# Altium schematic sheet Miscellaneous.SchDoc
size A3; PageSetup: Record=PageOptions|CenterHorizontal=True|CenterVertical=True|PrintScale=0.71|XCorrection=1.00|YCorrection=1.00|PrintKind=0|BorderSize=5000000|LeftOffset=0|BottomOffset=0|Orientation=2|PaperLength=1000|PaperWidth=1000|Scale=100|PaperSource=7|PrintQuality=-4|MediaType=1|DitherType=10|PaperKind=A4|PrintScaleMode=1; Date: 27.05.2014; DrawnBy: luths8; Organization: BFH; Address1: Bern University of Applied Sciences; Address2: Engineering and Information Technology; Address3: Jlcoweg 1; Address4: CH-3400 Burgdorf; DocumentNumber: 1; Revision: 1.0; CurrentDate: 27.05.2014
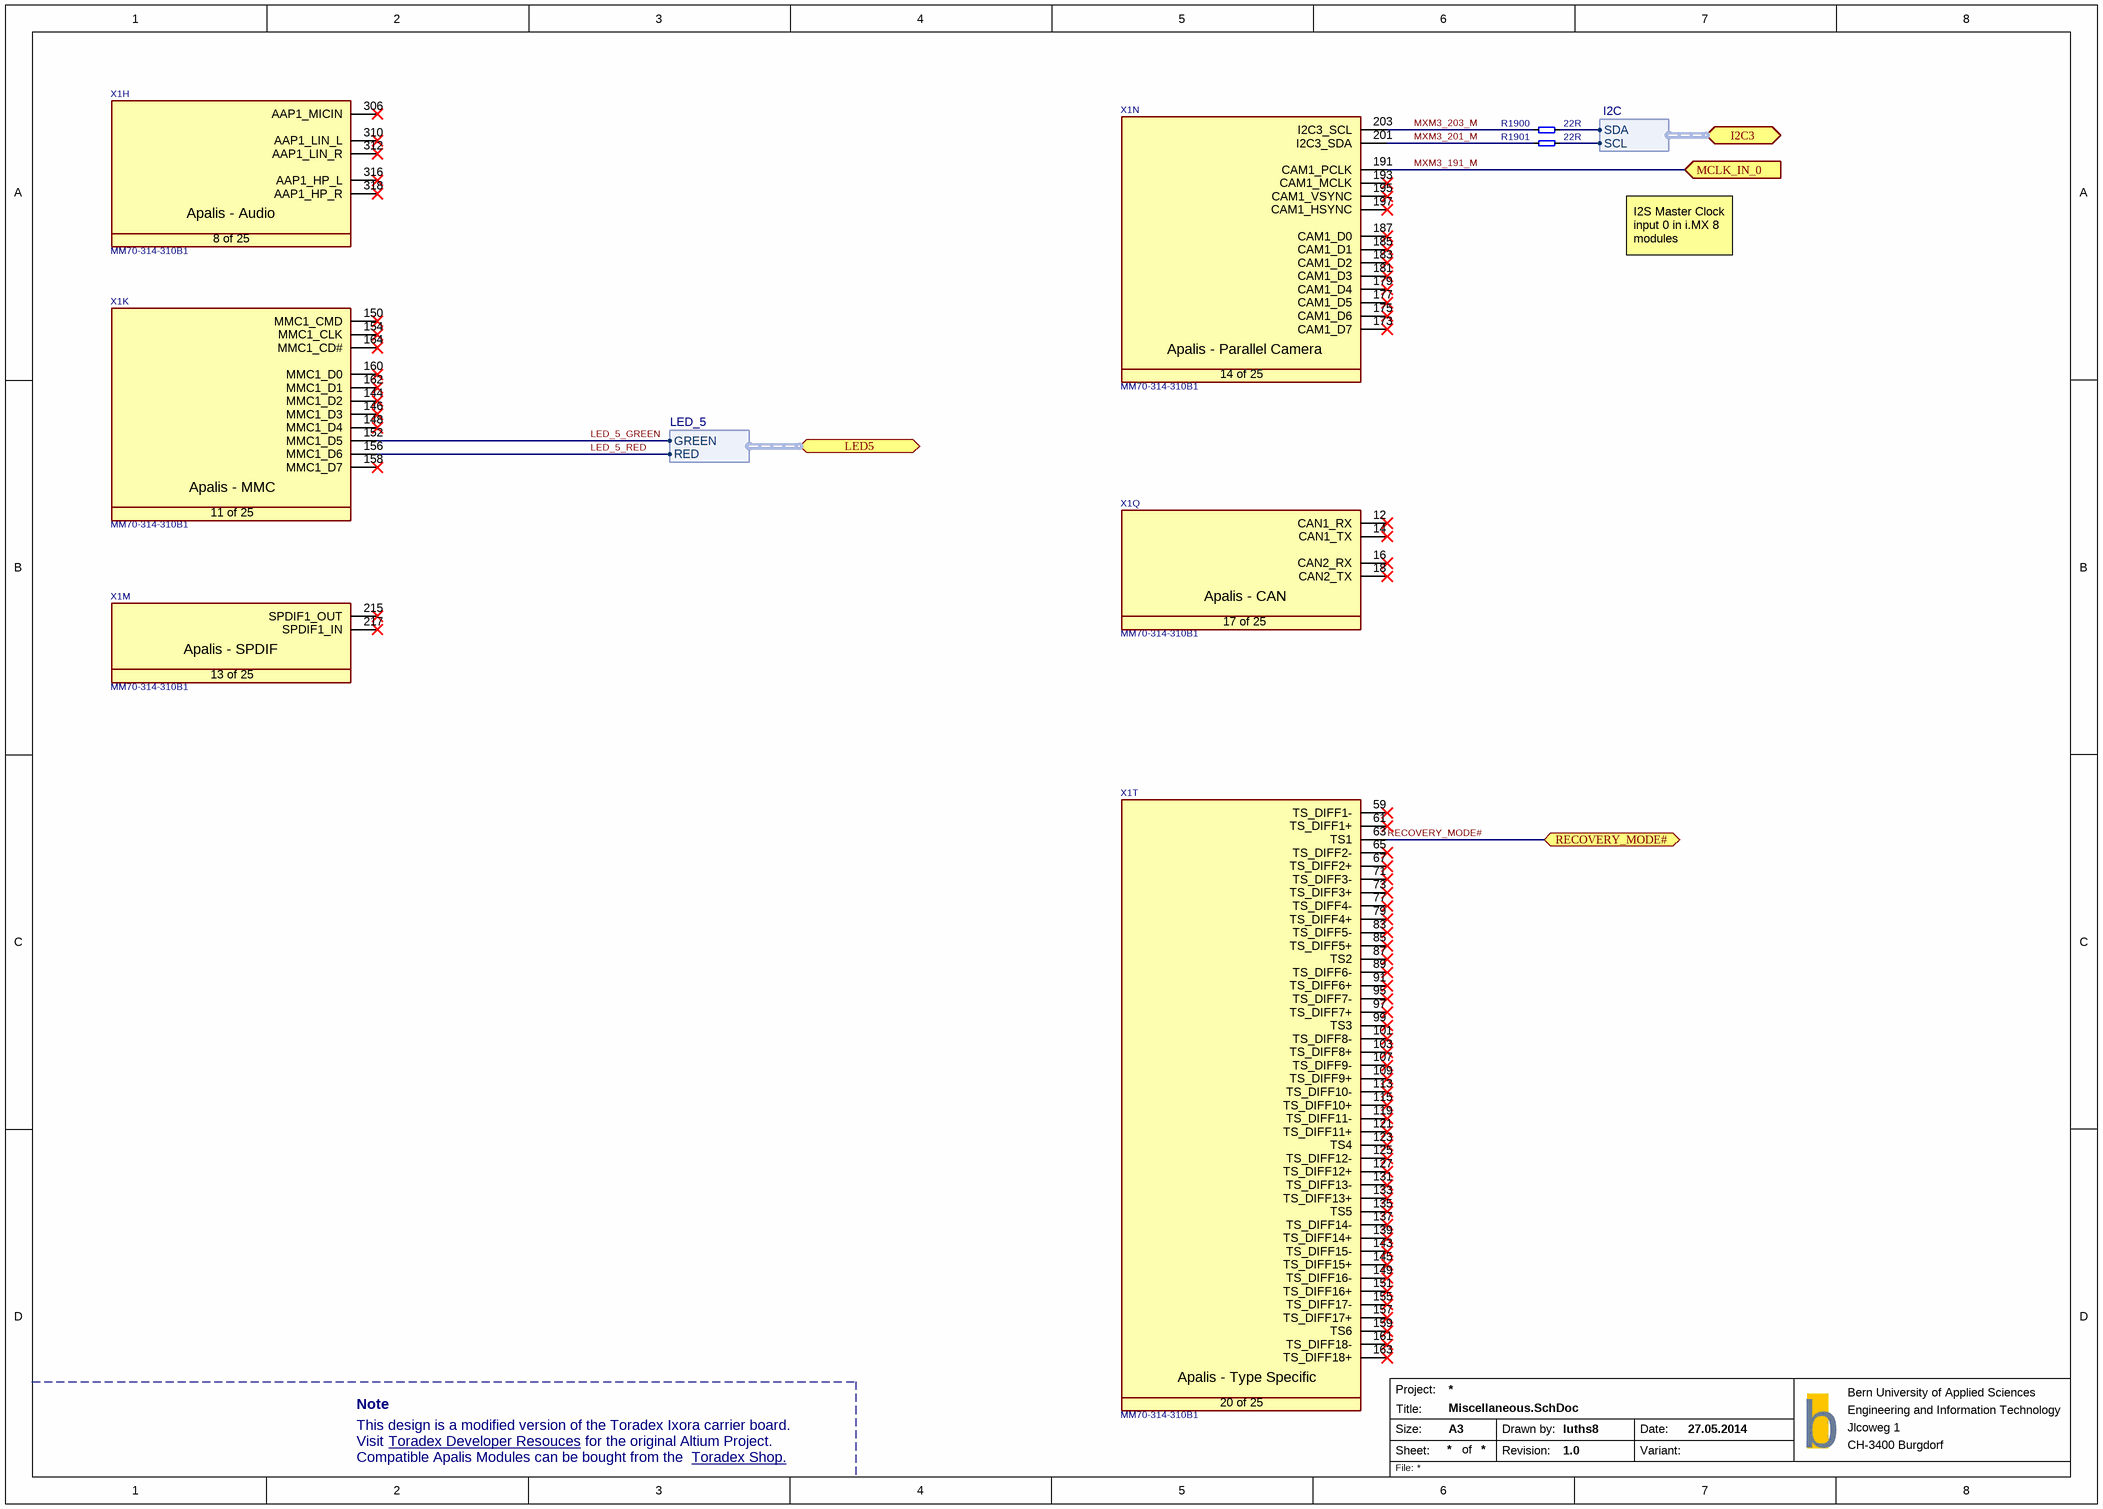
[diagram p0: Miscellaneous.SchDoc]

## Parts
R1900  22R  [SMD0603RES]
R1901  22R  [SMD0603RES]
X1  Manufacturer Part No.: MM70-314-310B1  [T_JAE_MM70-314-310B1]  (hidden comment: CON-JAE-MM70-314-310B1-314-0.5mm)  (parts H,K,M,N,Q,T of 25)

## Ports
I2C3 (bidir, harness I2C, see 12, 17, 19, 5), LED5 (bidir, harness LED_5, see 19), MCLK_IN_0 (in), RECOVERY_MODE# (bidir, see 19)

## Harnesses
LED_5: GREEN, RED
I2C: SCL, SDA

## Nets
LED_5_GREEN: X1.152(MMC1_D5) ; port LED5.GREEN
LED_5_RED: X1.156(MMC1_D6) ; port LED5.RED
MXM3_191_M: X1.191(CAM1_PCLK) ; port MCLK_IN_0
MXM3_201_M: R1901.1 X1.201(I2C3_SDA)
MXM3_203_M: R1900.1 X1.203(I2C3_SCL)
RECOVERY_MODE#: X1.63(TS1) ; port RECOVERY_MODE#
NetR1900_2: R1900.2 ; port I2C3.SDA
NetR1901_2: R1901.2 ; port I2C3.SCL

Not connected (* = marked no-connect by the designer): X1 12(CAN1_RX)* 14(CAN1_TX)* 16(CAN2_RX)* 18(CAN2_TX)* 59(TS_DIFF1-)* 61(TS_DIFF1+)* 65(TS_DIFF2-)* 67(TS_DIFF2+)* 71(TS_DIFF3-)* 73(TS_DIFF3+)* 77(TS_DIFF4-)* 79(TS_DIFF4+)* 83(TS_DIFF5-)* 85(TS_DIFF5+)* 87(TS2)* 89(TS_DIFF6-)* 91(TS_DIFF6+)* 95(TS_DIFF7-)* 97(TS_DIFF7+)* 99(TS3)* 101(TS_DIFF8-)* 103(TS_DIFF8+)* 107(TS_DIFF9-)* 109(TS_DIFF9+)* 113(TS_DIFF10-)* 115(TS_DIFF10+)* 119(TS_DIFF11-)* 121(TS_DIFF11+)* 123(TS4)* 125(TS_DIFF12-)* 127(TS_DIFF12+)* 131(TS_DIFF13-)* 133(TS_DIFF13+)* 135(TS5)* 137(TS_DIFF14-)* 139(TS_DIFF14+)* 143(TS_DIFF15-)* 144(MMC1_D2)* 145(TS_DIFF15+)* 146(MMC1_D3)* 148(MMC1_D4)* 149(TS_DIFF16-)* 150(MMC1_CMD)* 151(TS_DIFF16+)* 154(MMC1_CLK)* 155(TS_DIFF17-)* 157(TS_DIFF17+)* 158(MMC1_D7)* 159(TS6)* 160(MMC1_D0)* 161(TS_DIFF18-)* 162(MMC1_D1)* 163(TS_DIFF18+)* 164(MMC1_CD#)* 173(CAM1_D7)* 175(CAM1_D6)* 177(CAM1_D5)* 179(CAM1_D4)* 181(CAM1_D3)* 183(CAM1_D2)* 185(CAM1_D1)* 187(CAM1_D0)* 193(CAM1_MCLK)* 195(CAM1_VSYNC)* 197(CAM1_HSYNC)* 215(SPDIF1_OUT)* 217(SPDIF1_IN)* 306(AAP1_MICIN)* 310(AAP1_LIN_L)* 312(AAP1_LIN_R)* 316(AAP1_HP_L)* 318(AAP1_HP_R)*

## Notes on the sheet
- I2S Master Clock input 0 in i.MX 8 modules
- Note
- This design is a modified version of the Toradex Ixora carrier board.
- Visit
- Compatible Apalis Modules can be bought from the
- Toradex Developer Resouces <https://developer.toradex.com/products/ixora-carrier-board>
- for the original Altium Project.
- Toradex Shop. <https://www.toradex.com/order-now/apalis-arm-family>
- Project:
- Size:
- Sheet:
- Title:
- A3
- of
- Drawn by:
- Revision:
- Date:
- Variant:
- b
- File:
- (in symbol CON-JAE-MM70-314-310B1-314-0.5mm, part H) Apalis - Audio; 8 of 25
- (in symbol CON-JAE-MM70-314-310B1-314-0.5mm, part K) Apalis - MMC; 11 of 25
- (in symbol CON-JAE-MM70-314-310B1-314-0.5mm, part M) Apalis - SPDIF; 13 of 25
- (in symbol CON-JAE-MM70-314-310B1-314-0.5mm, part N) Apalis - Parallel Camera; 14 of 25
- (in symbol CON-JAE-MM70-314-310B1-314-0.5mm, part Q) Apalis - CAN; 17 of 25
- (in symbol CON-JAE-MM70-314-310B1-314-0.5mm, part T) Apalis - Type Specific; 20 of 25

## Library data of the parts
R1900 R1901 = R-22R-63mW-5%-0402: Resistor 22 ohm 63mW 5% 0603; Rating: 63mW; Tolerance: 5%; Value: 22R
X1 = CON-JAE-MM70-314-310B1-314-0.5mm: MXM3 Connector; Manufacturer Name: JAE; No. of ways: 314